# Altium project Phased_Array_Project.PrjPcb
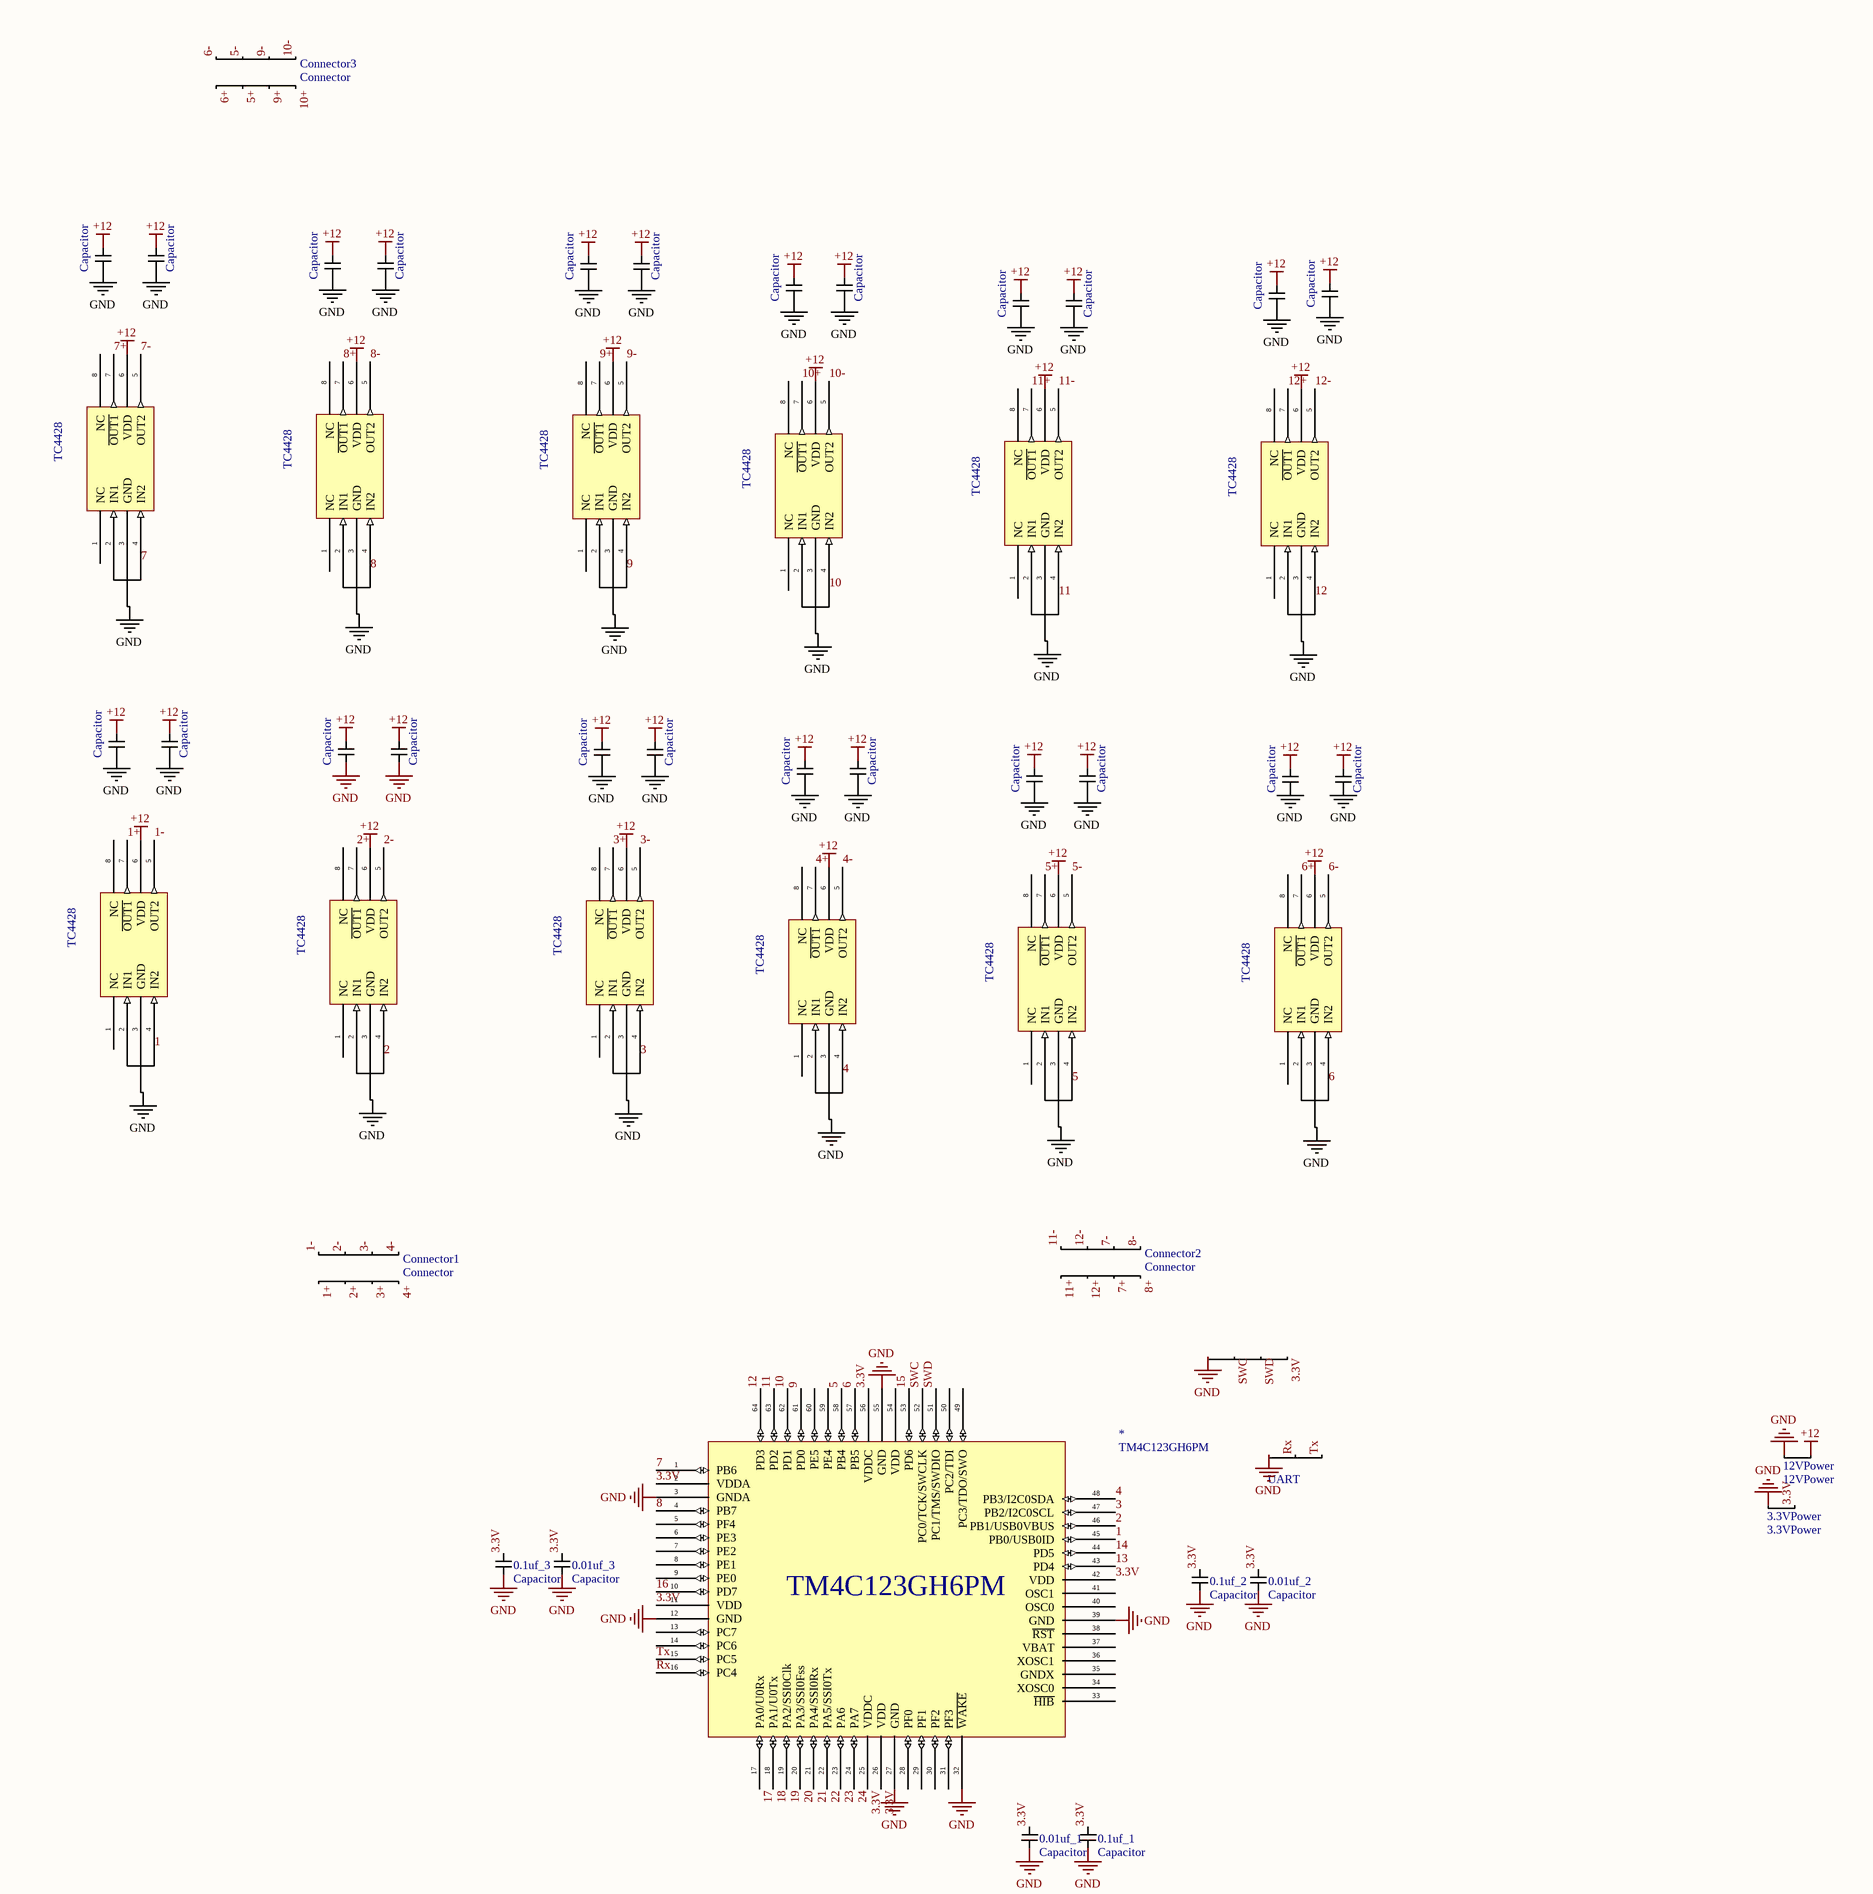
[diagram p0: Final Design.SchDoc, top]
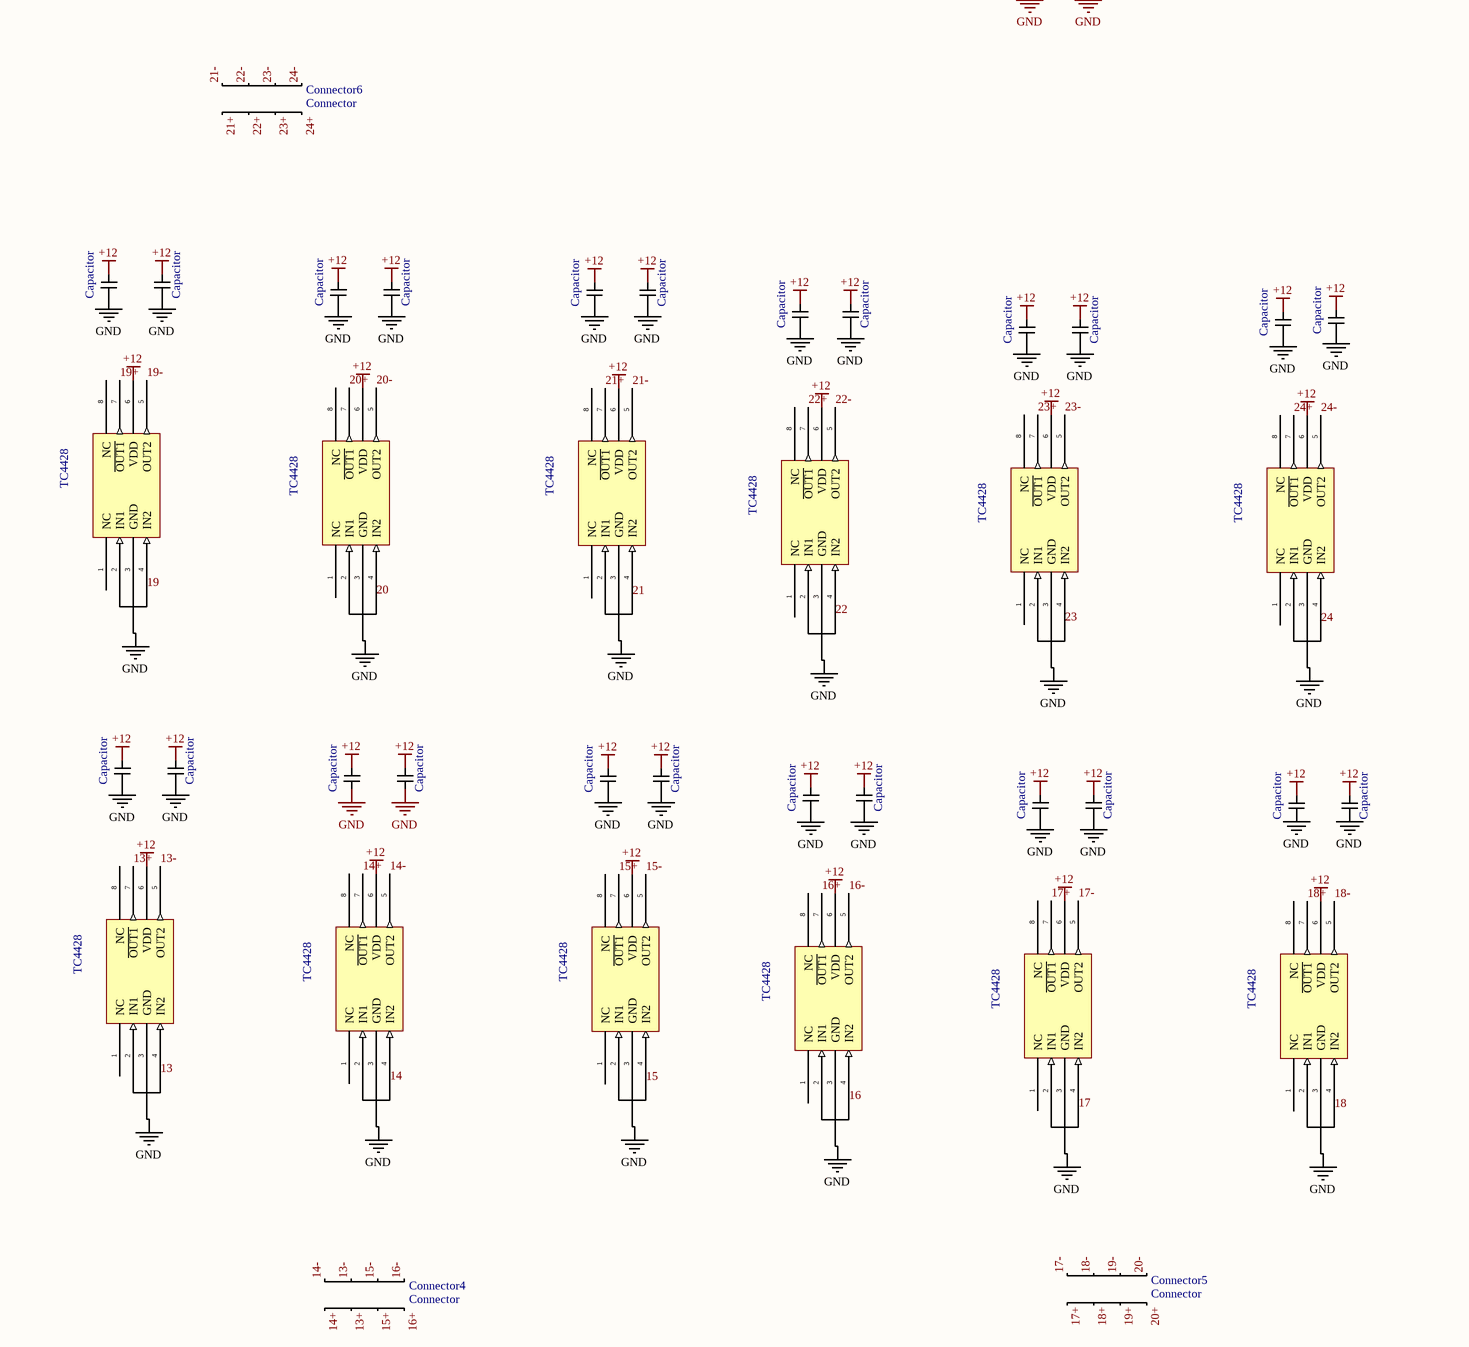
[diagram p1: Final Design.SchDoc, bottom]
1 sheet, 89 parts. Net scope: global (net labels, ports and power ports of the same name join across sheets).
Board file: PCB1.PcbDoc

## Sheet Final Design.SchDoc
size A0; Organization: Altium Limited; Address1: L3, 12a Rodborough Rd; Address2: Frenchs Forest; Address3: NSW; Address4: Australia 2086

### Parts
0.01uf_1  Capacitor  [Chip2PinSM127P600-8N]
0.1uf_1  Capacitor  [Chip2PinSM127P600-8N]
0.1uf_2  Capacitor  [Chip2PinSM127P600-8N]
0.01uf_2  Capacitor  [Chip2PinSM127P600-8N]
0.1uf_3  Capacitor  [Chip2PinSM127P600-8N]
0.01uf_3  Capacitor  [Chip2PinSM127P600-8N]
1  TC4428  [TC4428]
1.1  Capacitor  [Chip2PinSM127P600-8N]
1.2  Capacitor  [Chip2PinSM127P600-8N]
2  TC4428  [TC4428]
2.1  Capacitor  [Chip2PinSM127P600-8N]
2.2  Capacitor  [Chip2PinSM127P600-8N]
3  TC4428  [TC4428]
3.1  Capacitor  [Chip2PinSM127P600-8N]
3.2  Capacitor  [Chip2PinSM127P600-8N]
3.3VPower  3.3VPower  [12VPower]
4  TC4428  [TC4428]
4.1  Capacitor  [Chip2PinSM127P600-8N]
4.2  Capacitor  [Chip2PinSM127P600-8N]
5  TC4428  [TC4428]
5.1  Capacitor  [Chip2PinSM127P600-8N]
5.2  Capacitor  [Chip2PinSM127P600-8N]
6  TC4428  [TC4428]
6.1  Capacitor  [Chip2PinSM127P600-8N]
6.2  Capacitor  [Chip2PinSM127P600-8N]
7  TC4428  [TC4428]
7.1  Capacitor  [Chip2PinSM127P600-8N]
7.2  Capacitor  [Chip2PinSM127P600-8N]
8  TC4428  [TC4428]
8.1  Capacitor  [Chip2PinSM127P600-8N]
8.2  Capacitor  [Chip2PinSM127P600-8N]
9  TC4428  [TC4428]
9.1  Capacitor  [Chip2PinSM127P600-8N]
9.2  Capacitor  [Chip2PinSM127P600-8N]
10  TC4428  [TC4428]
10.1  Capacitor  [Chip2PinSM127P600-8N]
10.2  Capacitor  [Chip2PinSM127P600-8N]
11  TC4428  [TC4428]
11.1  Capacitor  [Chip2PinSM127P600-8N]
11.2  Capacitor  [Chip2PinSM127P600-8N]
12  TC4428  [TC4428]
12.1  Capacitor  [Chip2PinSM127P600-8N]
12.2  Capacitor  [Chip2PinSM127P600-8N]
12VPower  12VPower  [12VPower]
13  TC4428  [TC4428]
13.1  Capacitor  [Chip2PinSM127P600-8N]
13.2  Capacitor  [Chip2PinSM127P600-8N]
14  TC4428  [TC4428]
14.1  Capacitor  [Chip2PinSM127P600-8N]
14.2  Capacitor  [Chip2PinSM127P600-8N]
15  TC4428  [TC4428]
15.1  Capacitor  [Chip2PinSM127P600-8N]
15.2  Capacitor  [Chip2PinSM127P600-8N]
16  TC4428  [TC4428]
16.1  Capacitor  [Chip2PinSM127P600-8N]
16.2  Capacitor  [Chip2PinSM127P600-8N]
17  TC4428  [TC4428]
17+  Capacitor  [Chip2PinSM127P600-8N]
17-  Capacitor  [Chip2PinSM127P600-8N]
18  TC4428  [TC4428]
18.1  Capacitor  [Chip2PinSM127P600-8N]
18.2  Capacitor  [Chip2PinSM127P600-8N]
19  TC4428  [TC4428]
19.1  Capacitor  [Chip2PinSM127P600-8N]
19.2  Capacitor  [Chip2PinSM127P600-8N]
20  TC4428  [TC4428]
20.1  Capacitor  [Chip2PinSM127P600-8N]
20.2  Capacitor  [Chip2PinSM127P600-8N]
21  TC4428  [TC4428]
21.1  Capacitor  [Chip2PinSM127P600-8N]
21.2  Capacitor  [Chip2PinSM127P600-8N]
22  TC4428  [TC4428]
22.1  Capacitor  [Chip2PinSM127P600-8N]
22.2  Capacitor  [Chip2PinSM127P600-8N]
23  TC4428  [TC4428]
23.1  Capacitor  [Chip2PinSM127P600-8N]
23.2  Capacitor  [Chip2PinSM127P600-8N]
24  TC4428  [TC4428]
24.1  Capacitor  [Chip2PinSM127P600-8N]
24.2  Capacitor  [Chip2PinSM127P600-8N]
*  TM4C123GH6PM  [TM4CFinal]
Connector1  Connector  [Connector]
Connector2  Connector  [Connector]
Connector3  Connector  [Connector]
Connector4  Connector  [Connector]
Connector5  Connector  [Connector]
Connector6  Connector  [Connector]
JTAG  JTAG  [JTAG - duplicate]  (value not drawn)
UART  UART  [UART]

### Nets
+12: 1.6(VDD) 1.1.pin+(+) 1.2.pin+(+) 2.6(VDD) 2.1.pin+(+) 2.2.pin+(+) 3.6(VDD) 3.1.pin+(+) 3.2.pin+(+) 4.6(VDD) 4.1.pin+(+) 4.2.pin+(+) 5.6(VDD) 5.1.pin+(+) 5.2.pin+(+) 6.6(VDD) 6.1.pin+(+) 6.2.pin+(+) 7.6(VDD) 7.1.pin+(+) 7.2.pin+(+) 8.6(VDD) 8.1.pin+(+) 8.2.pin+(+) 9.6(VDD) 9.1.pin+(+) 9.2.pin+(+) 10.6(VDD) 10.1.pin+(+) 10.2.pin+(+) 11.6(VDD) 11.1.pin+(+) 11.2.pin+(+) 12.6(VDD) 12.1.pin+(+) 12.2.pin+(+) 12VPower.?2 13.6(VDD) 13.1.pin+(+) 13.2.pin+(+) 14.6(VDD) 14.1.pin+(+) 14.2.pin+(+) 15.6(VDD) 15.1.pin+(+) 15.2.pin+(+) 16.6(VDD) 16.1.pin+(+) 16.2.pin+(+) 17.6(VDD) 17+.pin+(+) 17-.pin+(+) 18.6(VDD) 18.1.pin+(+) 18.2.pin+(+) 19.6(VDD) 19.1.pin+(+) 19.2.pin+(+) 20.6(VDD) 20.1.pin+(+) 20.2.pin+(+) 21.6(VDD) 21.1.pin+(+) 21.2.pin+(+) 22.6(VDD) 22.1.pin+(+) 22.2.pin+(+) 23.6(VDD) 23.1.pin+(+) 23.2.pin+(+) 24.6(VDD) 24.1.pin+(+) 24.2.pin+(+)
GND: 0.01uf_1.pin-(-) 0.1uf_1.pin-(-) 0.1uf_2.pin-(-) 0.01uf_2.pin-(-) 0.1uf_3.pin-(-) 0.01uf_3.pin-(-) 1.3(GND) 1.1.pin-(-) 1.2.pin-(-) 2.3(GND) 2.1.pin-(-) 2.2.pin-(-) 3.3(GND) 3.1.pin-(-) 3.2.pin-(-) 3.3VPower.?1 4.3(GND) 4.1.pin-(-) 4.2.pin-(-) 5.3(GND) 5.1.pin-(-) 5.2.pin-(-) 6.3(GND) 7.3(GND) 7.1.pin-(-) 7.2.pin-(-) 8.3(GND) 8.1.pin-(-) 8.2.pin-(-) 9.3(GND) 9.1.pin-(-) 9.2.pin-(-) 10.3(GND) 10.1.pin-(-) 10.2.pin-(-) 11.3(GND) 11.1.pin-(-) 11.2.pin-(-) 12.3(GND) 12.1.pin-(-) 12VPower.?1 13.3(GND) 13.1.pin-(-) 13.2.pin-(-) 14.3(GND) 14.1.pin-(-) 14.2.pin-(-) 15.3(GND) 15.1.pin-(-) 15.2.pin-(-) 16.3(GND) 16.1.pin-(-) 16.2.pin-(-) 17.3(GND) 17+.pin-(-) 17-.pin-(-) 18.3(GND) 19.3(GND) 19.1.pin-(-) 19.2.pin-(-) 20.3(GND) 20.1.pin-(-) 20.2.pin-(-) 21.3(GND) 21.1.pin-(-) 21.2.pin-(-) 22.3(GND) 22.1.pin-(-) 22.2.pin-(-) 23.3(GND) 23.1.pin-(-) 23.2.pin-(-) 24.3(GND) 24.1.pin-(-) *.3(GNDA) *.12(GND) *.27(GND) *.32(~{WAKE}) *.39(GND) *.55(GND) JTAG.GND UART.GND
1: 1.2(IN1) 1.4(IN2) *.45(PB0/USB0ID)
1+: 1.7(~{OUT1}) Connector1.1
1-: 1.5(OUT2) Connector1.8
2: 2.2(IN1) 2.4(IN2) *.46(PB1/USB0VBUS)
2+: 2.7(~{OUT1}) Connector1.2
2-: 2.5(OUT2) Connector1.7
3: 3.2(IN1) 3.4(IN2) *.47(PB2/I2C0SCL)
3+: 3.7(~{OUT1}) Connector1.3
3-: 3.5(OUT2) Connector1.6
3.3V: 0.01uf_1.pin+(+) 0.1uf_1.pin+(+) 0.1uf_2.pin+(+) 0.01uf_2.pin+(+) 0.1uf_3.pin+(+) 0.01uf_3.pin+(+) 3.3VPower.?2 *.2(VDDA) *.11(VDD) *.25(VDDC) *.26(VDD) *.42(VDD) *.56(VDDC) JTAG.3.3V
4: 4.2(IN1) 4.4(IN2) *.48(PB3/I2C0SDA)
4+: 4.7(~{OUT1}) Connector1.4
4-: 4.5(OUT2) Connector1.5
5: 5.2(IN1) 5.4(IN2) *.58(PB4)
5+: 5.7(~{OUT1}) Connector3.2
5-: 5.5(OUT2) Connector3.7
6: 6.2(IN1) 6.4(IN2) *.57(PB5)
6+: 6.7(~{OUT1}) Connector3.1
6-: 6.5(OUT2) Connector3.8
7: 7.2(IN1) 7.4(IN2) *.1(PB6)
7+: 7.7(~{OUT1}) Connector2.3
7-: 7.5(OUT2) Connector2.6
8: 8.2(IN1) 8.4(IN2) *.4(PB7)
8+: 8.7(~{OUT1}) Connector2.4
8-: 8.5(OUT2) Connector2.5
9: 9.2(IN1) 9.4(IN2) *.61(PD0)
9+: 9.7(~{OUT1}) Connector3.3
9-: 9.5(OUT2) Connector3.6
10: 10.2(IN1) 10.4(IN2) *.62(PD1)
10+: 10.7(~{OUT1}) Connector3.4
10-: 10.5(OUT2) Connector3.5
11: 11.2(IN1) 11.4(IN2) *.63(PD2)
11+: 11.7(~{OUT1}) Connector2.1
11-: 11.5(OUT2) Connector2.8
12: 12.2(IN1) 12.4(IN2) *.64(PD3)
12+: 12.7(~{OUT1}) Connector2.2
12-: 12.5(OUT2) Connector2.7
13: 13.2(IN1) 13.4(IN2) *.43(PD4)
13+: 13.7(~{OUT1}) Connector4.2
13-: 13.5(OUT2) Connector4.7
14: 14.2(IN1) 14.4(IN2) *.44(PD5)
14+: 14.7(~{OUT1}) Connector4.1
14-: 14.5(OUT2) Connector4.8
15: 15.2(IN1) 15.4(IN2) *.53(PD6)
15+: 15.7(~{OUT1}) Connector4.3
15-: 15.5(OUT2) Connector4.6
16: 16.2(IN1) 16.4(IN2) *.10(PD7)
16+: 16.7(~{OUT1}) Connector4.4
16-: 16.5(OUT2) Connector4.5
17: 17.2(IN1) 17.4(IN2) *.17(PA0/U0Rx)
17+: 17.7(~{OUT1}) Connector5.1
17-: 17.5(OUT2) Connector5.8
18: 18.2(IN1) 18.4(IN2) *.18(PA1/U0Tx)
18+: 18.7(~{OUT1}) Connector5.2
18-: 18.5(OUT2) Connector5.7
19: 19.2(IN1) 19.4(IN2) *.19(PA2/SSI0Clk)
19+: 19.7(~{OUT1}) Connector5.3
19-: 19.5(OUT2) Connector5.6
20: 20.2(IN1) 20.4(IN2) *.20(PA3/SSI0Fss)
20+: 20.7(~{OUT1}) Connector5.4
20-: 20.5(OUT2) Connector5.5
21: 21.2(IN1) 21.4(IN2) *.21(PA4/SSI0Rx)
21+: 21.7(~{OUT1}) Connector6.1
21-: 21.5(OUT2) Connector6.8
22: 22.2(IN1) 22.4(IN2) *.22(PA5/SSI0Tx)
22+: 22.7(~{OUT1}) Connector6.2
22-: 22.5(OUT2) Connector6.7
23: 23.2(IN1) 23.4(IN2) *.23(PA6)
23+: 23.7(~{OUT1}) Connector6.3
23-: 23.5(OUT2) Connector6.6
24: 24.2(IN1) 24.4(IN2) *.24(PA7)
24+: 24.7(~{OUT1}) Connector6.4
24-: 24.5(OUT2) Connector6.5
Rx: *.16(PC4) UART.TX
SWC: *.52(PC0/TCK/SWCLK) JTAG.SWC
SWD: *.51(PC1/TMS/SWDIO) JTAG.SWD
Tx: *.15(PC5) UART.RX

Not connected (* = marked no-connect by the designer): 1 1(NC) 8(NC); 2 1(NC) 8(NC); 3 1(NC) 8(NC); 4 1(NC) 8(NC); 5 1(NC) 8(NC); 6 1(NC) 8(NC); 6.1 pin-(-); 6.2 pin-(-); 7 1(NC) 8(NC); 8 1(NC) 8(NC); 9 1(NC) 8(NC); 10 1(NC) 8(NC); 11 1(NC) 8(NC); 12 1(NC) 8(NC); 12.2 pin-(-); 13 1(NC) 8(NC); 14 1(NC) 8(NC); 15 1(NC) 8(NC); 16 1(NC) 8(NC); 17 1(NC) 8(NC); 18 1(NC) 8(NC); 18.1 pin-(-); 18.2 pin-(-); 19 1(NC) 8(NC); 20 1(NC) 8(NC); 21 1(NC) 8(NC); 22 1(NC) 8(NC); 23 1(NC) 8(NC); 24 1(NC) 8(NC); 24.2 pin-(-); * 5(PF4) 6(PE3) 7(PE2) 8(PE1) 9(PE0) 13(PC7) 14(PC6) 28(PF0) 29(PF1) 30(PF2) 31(PF3) 33(~{HIB}) 34(XOSC0) 35(GNDX) 36(XOSC1) 37(VBAT) 38(~{RST}) 40(OSC0) 41(OSC1) 49(PC3/TDO/SWO) 50(PC2/TDI) 54(VDD) 59(PE4) 60(PE5)

### Notes on the sheet
- Labels drawn without touching a wire or pin: GND
- Title
- Size:
- Date:
- File:
- A0
- Number:
- Time:
- Revision:
- Sheet
- of

### Library data of the parts
1-24 = TC4428: Dual High-Speed Power MOSFET Drivers
* = TM4C123GH6PM: IC MCU 32BIT 256KB FLASH 64LQFP